# Altium schematic sheet DELA EPROMMER II.SchDoc
size 420 x 297 mm; ApprovedBy: .; CheckedBy: .; Author: DiWou; CompanyName: DL2DW; DrawnBy: DiWou; Engineer: .; Organization: DL2DW; DocumentNumber: 1; Revision: -; SheetNumber: 1; SheetTotal: 1; DrawnDate: 13.05.2018; EngrDate: .; ChkdDate: .; Title1: DELA EPROMMER II; Title2: .; Title3: .; Desc1: Version 1.0; Desc2: .; ApprDate: .
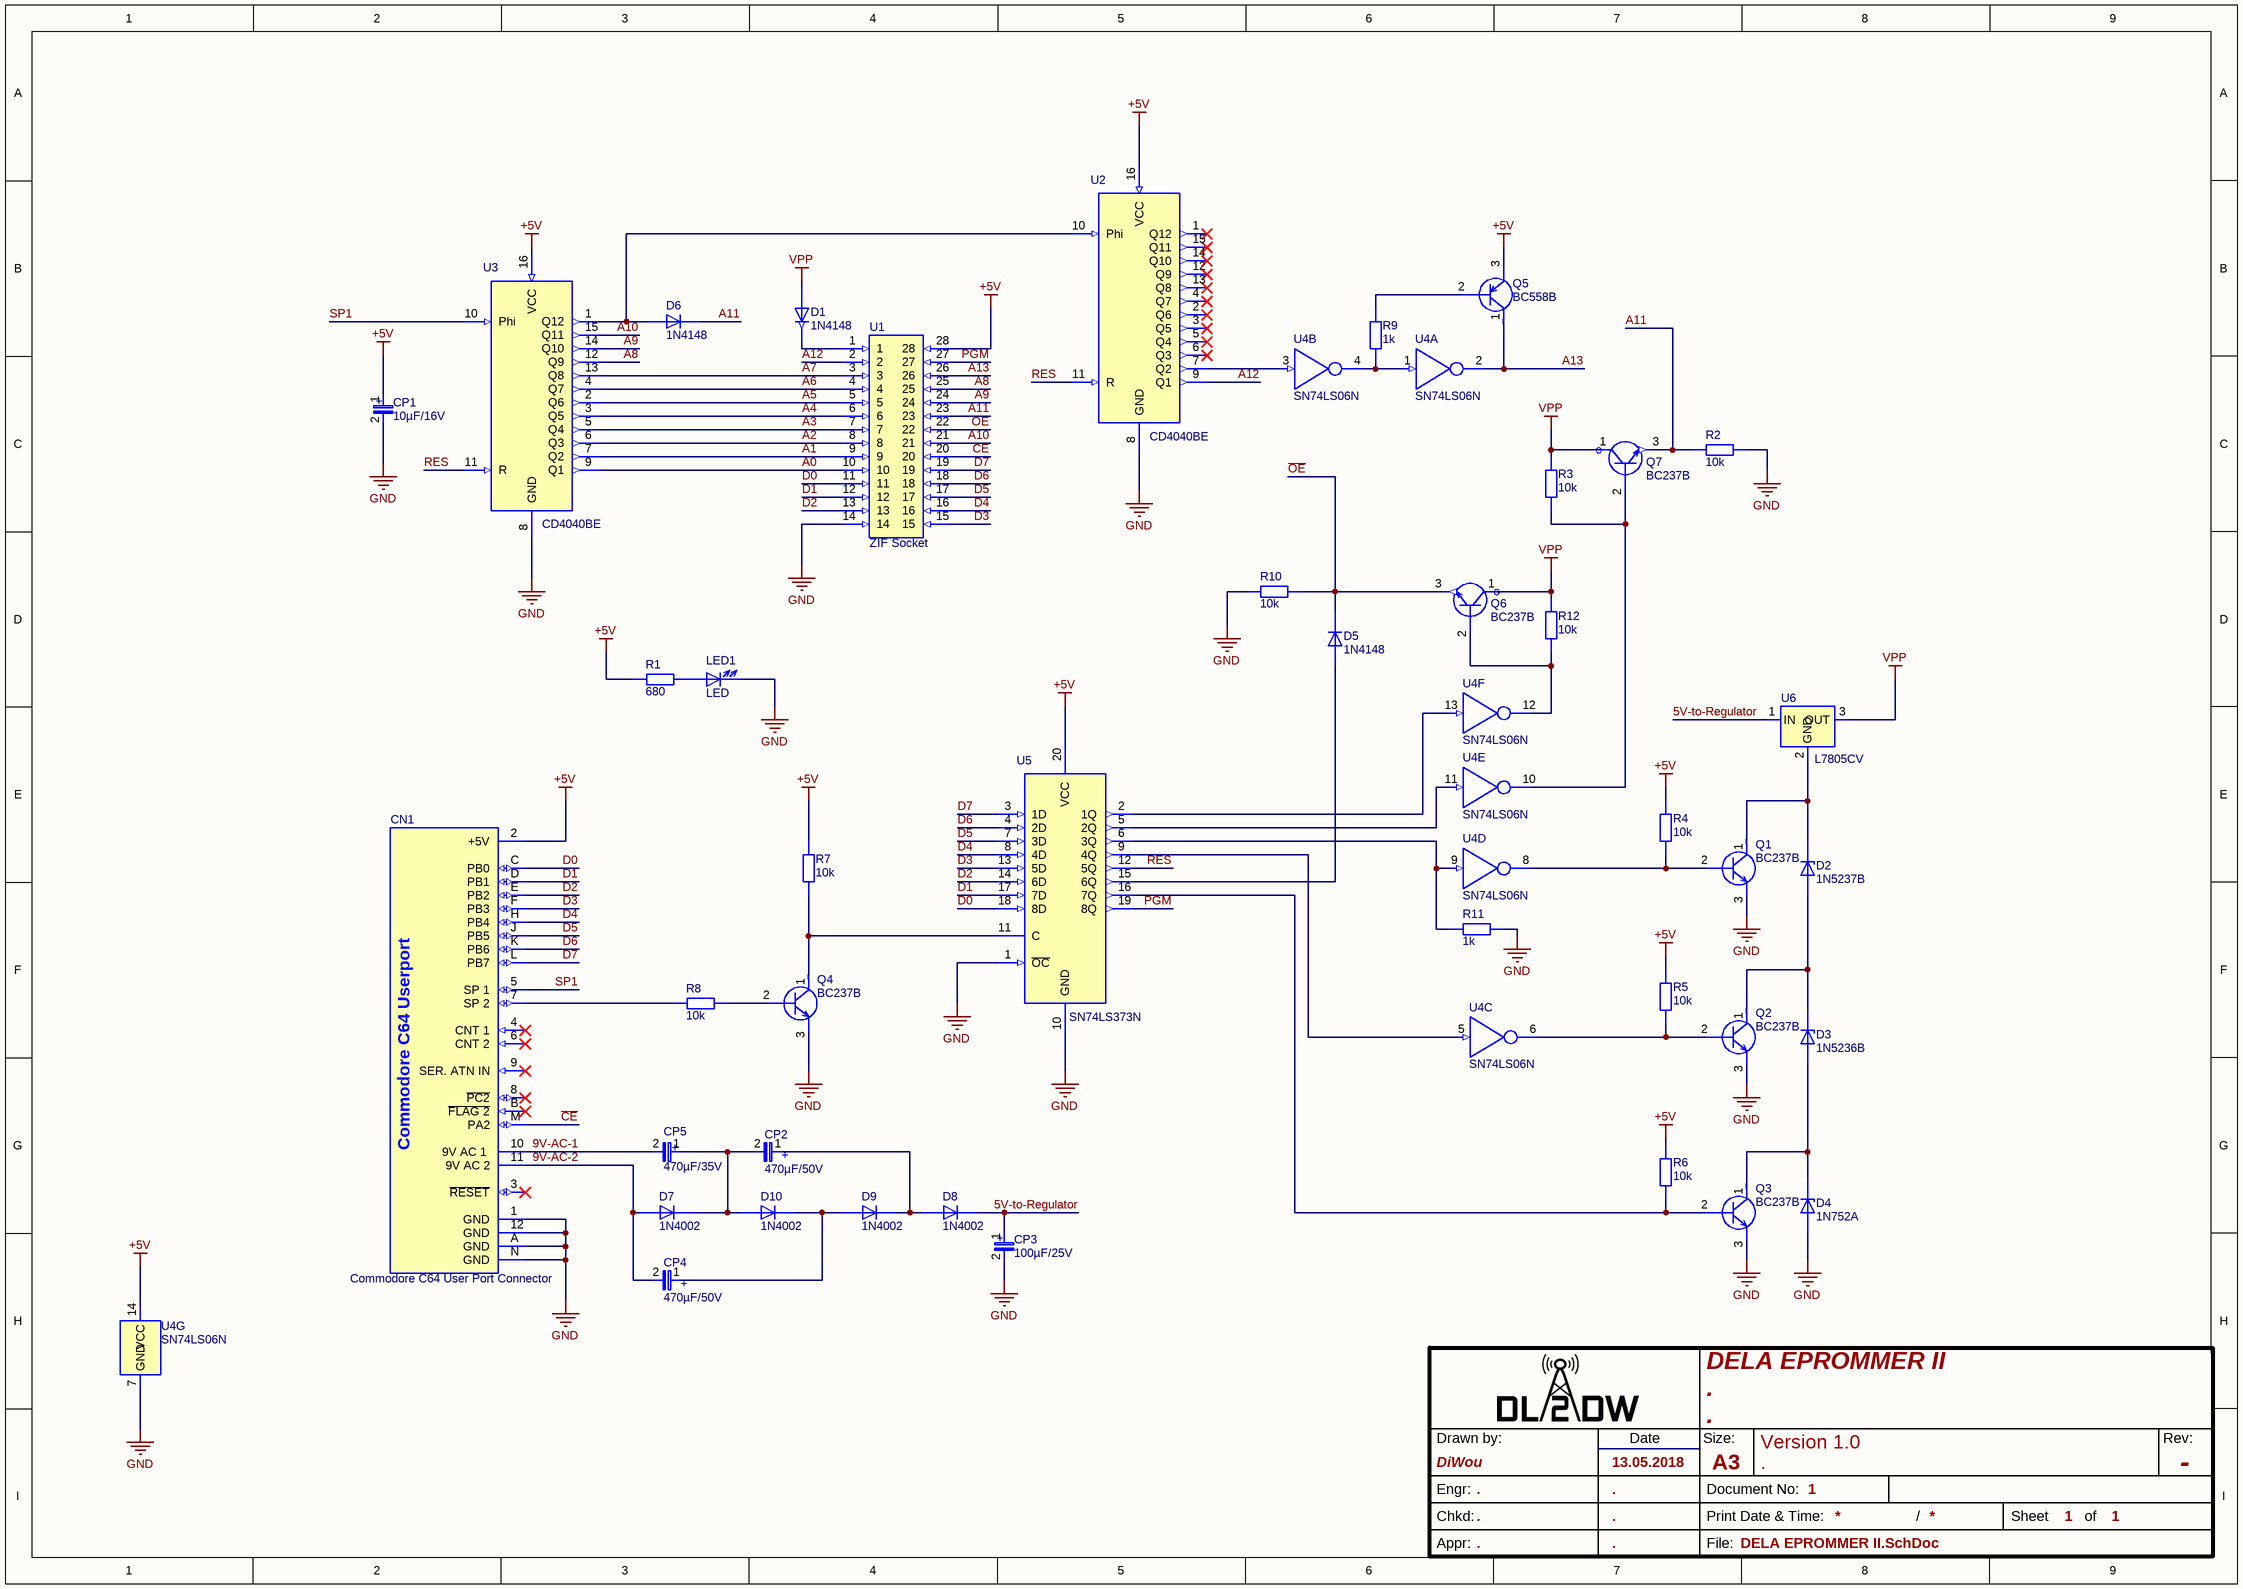
[diagram p0: DELA EPROMMER II.SchDoc]

## Parts
CN1  Commodore C64 User Port Connector  [C64 User Port Connector]
CP1  10µF/16V  [CAP Elec 10µF 16V RND 150EHR100M16B]
CP2  470µF/50V  [CAP Elec. 470µF 50V Panasonic ECA1HHG471]
CP3  100µF/25V  [CAP Elec 100µF 25V Panasonic ECA1EHG101]
CP4  470µF/50V  [CAP Elec. 470µF 50V Panasonic ECA1HHG471]
CP5  470µF/35V  [CAP Elec 470µF 35V Panasonic ECA1VHG471]
D1  1N4148  [1N4148 P=5.08mm]
D2  1N5237B  [1N5237B  P=5.08mm]
D3  1N5236B  [1N5236B  P=5.08mm]
D4  1N752A  [1N752A P=5.08mm]
D5  1N4148  [1N4148 P=5.08mm]
D6  1N4148  [1N4148 P=5.08mm]
D7  1N4002  [1N4002 P=7.62mm]
D8  1N4002  [1N4002 P=7.62mm]
D9  1N4002  [1N4002 P=7.62mm]
D10  1N4002  [1N4002 P=7.62mm]
LED1  LED  [LED 3mm Red Straight]
Q1  BC237B  [BC237]
Q2  BC237B  [BC237]
Q3  BC237B  [BC237]
Q4  BC237B  [BC237]
Q5  BC558B  [BC558B]
Q6  BC237B  [BC237]
Q7  BC237B  [BC237]
R1  680  [680 kOhm R Axial DIN0207 L6.3mm D2.5mm P7.62mm Horizontal]
R2  10k  [10 kOhm R Axial DIN0207 L6.3mm D2.5mm P7.62mm Horizontal]
R3  10k  [10 kOhm R Axial DIN0207 L6.3mm D2.5mm P7.62mm Horizontal]
R4  10k  [10 kOhm R Axial DIN0207 L6.3mm D2.5mm P7.62mm Horizontal]
R5  10k  [10 kOhm R Axial DIN0207 L6.3mm D2.5mm P7.62mm Horizontal]
R6  10k  [10 kOhm R Axial DIN0207 L6.3mm D2.5mm P7.62mm Horizontal]
R7  10k  [10 kOhm R Axial DIN0207 L6.3mm D2.5mm P7.62mm Horizontal]
R8  10k  [10 kOhm R Axial DIN0207 L6.3mm D2.5mm P7.62mm Horizontal]
R9  1k  [1,0 kOhm R Axial DIN0207 L6.3mm D2.5mm P7.62mm Horizontal]
R10  10k  [10 kOhm R Axial DIN0207 L6.3mm D2.5mm P7.62mm Horizontal]
R11  1k  [1,0 kOhm R Axial DIN0207 L6.3mm D2.5mm P7.62mm Horizontal]
R12  10k  [10 kOhm R Axial DIN0207 L6.3mm D2.5mm P7.62mm Horizontal]
U1  ZIF Socket  [ZIF Socket Textool 28pos P=15.24mm]
U2  CD4040BE  [CD4040BE with Socket]
U3  CD4040BE  [CD4040BE with Socket]
U4  SN74LS06N  [SN74LS06N with Socket]  (parts A,B,C,D,E,F,G of 7)
U5  SN74LS373N  [SN74LS373N with Socket]
U6  L7805CV  [L 7805 CV]

## Nets
+5V: CN1.2(+5V) CP1.1 Q5.3 R1.2 R4.1 R5.1 R6.1 R7.1 U1.28 U2.16(VCC) U3.16(VCC) U4.14(VCC) U5.20(VCC)
GND: CN1.1(GND) CN1.12(GND) CN1.A(GND) CN1.N(GND) CP1.2 CP3.2 D4.2 LED1.1 Q1.3 Q2.3 Q3.3 Q4.3 R2.1 R10.2 R11.2 U1.14 U2.8(GND) U3.8(GND) U4.7(GND) U5.1(~{OC}) U5.10(GND)
VPP: D1.2 Q6.1 Q7.1 R3.1 R12.1 U6.3(OUT)
5V-to-Regulator: CP3.1 D8.1 U6.1(IN)
9V-AC-1: CN1.10(9V_AC_1) CP5.2
9V-AC-2: CN1.11(9V_AC_2) CP4.2 D7.2
A0: U1.10 U3.9(Q1)
A1: U1.9 U3.7(Q2)
A2: U1.8 U3.6(Q3)
A3: U1.7 U3.5(Q4)
A4: U1.6 U3.3(Q5)
A5: U1.5 U3.2(Q6)
A6: U1.4 U3.4(Q7)
A7: U1.3 U3.13(Q8)
A8: U1.25 U3.12(Q9)
A9: U1.24 U3.14(Q10)
A10: U1.21 U3.15(Q11)
A11: D6.1 Q7.3 R2.2 U1.23
A12: U1.2 U2.9(Q1)
A13: Q5.1 U1.26 U4.2(1Y)
~{CE}: CN1.M(PA2) U1.20
D0: CN1.C(PB0) U1.11 U5.18(8D)
D1: CN1.D(PB1) U1.12 U5.17(7D)
D2: CN1.E(PB2) U1.13 U5.14(6D)
D3: CN1.F(PB3) U1.15 U5.13(5D)
D4: CN1.H(PB4) U1.16 U5.8(4D)
D5: CN1.J(PB5) U1.17 U5.7(3D)
D6: CN1.K(PB6) U1.18 U5.4(2D)
D7: CN1.L(PB7) U1.19 U5.3(1D)
~{OE}: D5.1 Q6.3 R10.1 U1.22
~{PGM}: U1.27 U5.19(8Q)
RES: U2.11(R) U3.11(R) U5.12(5Q)
SP1: CN1.5(SP_1) U3.10(Phi)
NetCN1_7: CN1.7(SP_2) R8.1
NetCP2_1: CP2.1 D8.2 D9.1
NetCP2_2: CP2.2 CP5.1 D7.1 D10.2
NetCP4_1: CP4.1 D9.2 D10.1
NetD1_1: D1.1 U1.1
NetD2_1: D2.1 Q1.1 U6.2(GND)
NetD2_2: D2.2 D3.1 Q2.1
NetD3_2: D3.2 D4.1 Q3.1
NetD5_2: D5.2 U5.15(6Q)
NetD6_2: D6.2 U2.10(Phi) U3.1(Q12)
NetLED1_2: LED1.2 R1.1
NetQ1_2: Q1.2 R4.2 U4.8(4Y)
NetQ2_2: Q2.2 R5.2 U4.6(3Y)
NetQ3_2: Q3.2 R6.2 U5.16(7Q)
NetQ4_1: Q4.1 R7.2 U5.11(C)
NetQ4_2: Q4.2 R8.2
NetQ5_2: Q5.2 R9.1
NetQ6_2: Q6.2 R12.2 U4.12(6Y)
NetQ7_2: Q7.2 R3.2 U4.10(5Y)
NetR9_2: R9.2 U4.1(1A) U4.4(2Y)
NetR11_1: R11.1 U4.9(4A) U5.6(3Q)
NetU2_7: U2.7(Q2) U4.3(2A)
NetU4_5: U4.5(3A) U5.9(4Q)
NetU4_11: U4.11(5A) U5.5(2Q)
NetU4_13: U4.13(6A) U5.2(1Q)

Not connected (* = marked no-connect by the designer): CN1 3(~{RESET})* 4(CNT_1)* 6(CNT_2)* 8(~{PC2})* 9(SER._ATN_IN)* B(~{FLAG_2})*; U2 1(Q12)* 2(Q6)* 3(Q5)* 4(Q7)* 5(Q4)* 6(Q3)* 12(Q9)* 13(Q8)* 14(Q10)* 15(Q11)*; U6 4(N/C)

## Notes on the sheet
- Drawn by:
- Date
- Size:
- A3
- Rev:
- Engr:
- Chkd:
- Appr:
- File:
- Document No:
- Print Date & Time:
- /
- Sheet
- of
- (in symbol CMP-Capacitors-Electrolyt_Capacitors00019-2) +
- (in symbol CMP-Capacitors-Electrolyt_Capacitors00020-1) +
- (in symbol CMP-Capacitors-Electrolyt_Capacitors00021-1) +
- (in symbol CMP-Capacitors-Electrolyt_Capacitors00022-1) +
- (in symbol CMP-Commodore-00001-1) Commodore C64 Userport

## Library data of the parts
CN1 = CMP-Commodore-00001-1: Connector for soldering on the board, for connection to the user port of the C64.
CP1 = CMP-Capacitors-Electrolyt_Capacitors00020-1: RND 150EHR100M16B - Kondensator, 10µF, 16V, 20%, RND Components
CP2 CP4 = CMP-Capacitors-Electrolyt_Capacitors00019-2: Capacitor 470 uF 50 VDC, ECA1HHG471, Panasonic Automotive & Industrial Systems; Lead/Base Style: Straight; Voltage: 50V; Dissipation Factor: 0.12%; Capacitance: 470uF; Ripple Current: 530mA; Lead Diameter: 0.6mm; Tolerance: 20%; Life (Hours): 2000Hour; Leakage Current: 3uA; Height - Seated (Max): 0.866inch; Number of Pins: 2; Package Quantity: 200; Voltage Rating (DC): 50V; Radiation Hardening: No; Max Operating Temperature: 105°C; Ripple Current (AC): 530mA; Lead Pitch: 5mm; Diameter: 10mm; REACH SVHC: No SVHC; Termination: Radial; Mount: Through Hole,PCB; Case/Package: Radial; Contact Plating: Tin; Length: 20mm; Min Operating Temperature: -55°C; Height: 20mm; Packaging: Bulk; Voltage Rating: 50V
CP3 = CMP-Capacitors-Electrolyt_Capacitors00022-1: Capacitor 100 uF 25 VDC, ECA1EHG101, Panasonic Automotive & Industrial Systems; Polarity: Polar; Voltage Rating (DC): 25V; Lead Diameter: 0.5mm; Dissipation Factor: 0.16%; Capacitance: 100uF; Ripple Current (AC): 130mA; Tolerance: 20%; Lead/Base Style: Straight; Life (Hours): 1000Hour; Leakage Current: 3uA; Height - Seated (Max): 0.48inch; Packaging: Bulk; Termination: Radial; Voltage Rating: 25V; Number of Pins: 2; Length: 11.2mm; Height: 11.2mm; Min Operating Temperature: -55°C; Diameter: 6.3mm; Lead Pitch: 2.5mm; Width: 0inch; Max Operating Temperature: 105°C; Case/Package: Radial; Mount: Through Hole,PCB; REACH SVHC: No SVHC; Package Quantity: 200; Voltage: 25V; Radiation Hardening: No; Ripple Current: 130mA
CP5 = CMP-Capacitors-Electrolyt_Capacitors00021-1: ALUMINUM ELECTROLYTIC CAPACITOR, 470UF, 35V, 20%, RADIAL; Product Range:NHG Series; Capacitance:470 F; Capacitance Tolerance: 20%; Voltage Rating:35V; Diameter:10mm; Capacitor Terminals:Radial Leaded; Packaging:Each; ESR:- ;RoHS Compliant: Yes; Polarity: Polar; Leakage Current: 3uA; Ripple Current: 460mA; Dielectric Material: Aluminium; Life (Hours): 2000Hour; Lead/Base Style: Straight; Dissipation Factor: 0.14%; Lead Diameter: 0.6mm; Height: 16mm; Lead Free: Lead Free; Max Operating Temperature: 105°C; Voltage Rating (DC): 35V; Termination: Radial; Tolerance: 20%; Voltage: 35V; Voltage Rating: 35V; Case/Package: Radial; Length: 16mm; Contact Plating: Tin; Capacitance: 470uF; Min Operating Temperature: -55°C; REACH SVHC: No SVHC; Package Quantity: 200; Height - Seated (Max): 0.669inch; Number of Pins: 2; Diameter: 10mm; Lead Pitch: 5mm; Mount: Through Hole,PCB; Packaging: Bulk; Radiation Hardening: No
D1 D5 D6 = CMP-Diodes-00002-4: NEXPERIA - 1N4148 - DIODE, 1N4148 AMMO-BOX 10K; Reverse Recovery Time: 4ns; Capacitance: 4pF; Element Configuration: Single; Current: 4A; Output Current: 200mA; Voltage Rating (DC): 100V; Max Power Dissipation: 500mW; Polarity: Standard; Forward Voltage: 1V; Weight: 0.01lb; Lead Free: Lead Free; Length: 2.5inch; Termination: Axial; Voltage: 100V; Forward Current: 200mA; Width: 0.25inch; Packaging: Ammo Pack; Max Repetitive Reverse Voltage (Vrrm): 100V; Max Operating Temperature: 200°C; Number of Pins: 2; Case/Package: SOD; Max Forward Surge Current (Ifsm): 4A; Height: 0.25inch; Peak Non-Repetitive Surge Current: 4A; Radiation Hardening: No; REACH SVHC: No SVHC; Current Rating: 200mA; Min Operating Temperature: -65°C
D2 = CMP-Diodes-00017-1: ZENER DIODE, 500mW, 8.2V, DO-35; Zener Voltage Vz Typ:8.2V; Power Dissipation Pd:500mW; Diode Case Style:DO-35; Zener Tolerance :5%; No. of Pins:2Pins; Operating Temperature Max:200 C; Packaging:Each; Breakdown Voltage:8.2V ;RoHS Compliant: Yes; Zener Current: 20mA; Voltage Tolerance: 5%; Peak Reverse Current: 3uA; Element Configuration: Single; Impedance: 8R; Forward Voltage: 1.2V; Height: 0.5inch; Lead Free: Lead Free; Max Operating Temperature: 200°C; Weight: 80g; Width: 0.5inch; Max Power Dissipation: 500mW; Packaging: Bulk; Tolerance: 5%; Package Quantity: 1000; Power Rating: 500mW; REACH SVHC: No SVHC; Working Voltage: 8.2V; Power Dissipation: 500mW; Min Operating Temperature: -65°C; Mount: Through Hole; Test Current: 20mA; Radiation Hardening: No; Max Reverse Leakage Current: 3uA; Voltage Rating (DC): 8.2V; Number of Pins: 2; Breakdown Voltage: 8.2V; Length: 0.5inch; Zener Voltage: 8.2V
D3 = CMP-Diodes-00016-1: FAIRCHILD SEMICONDUCTOR         1N5236B             Zener Single Diode, 7.5 V, 500 mW, DO-35, 5 %, 2 Pins, 200 C; Max Power Dissipation: 500mW; Peak Reverse Current: 3uA; Zener Voltage: 7.5V; Impedance: 6R; Test Current: 20mA; Voltage Tolerance: 5%; Forward Voltage: 1.2V; Mount: Through Hole; Voltage Rating (DC): 7.5V; Min Operating Temperature: -65°C; Weight: 0.01lb; Power Dissipation: 500mW; Width: 1.91mm; Element Configuration: Single; Lead Free: Lead Free; Zener Current: 20mA; Packaging: Bulk; Max Reverse Leakage Current: 3uA; Working Voltage: 7.5V; REACH SVHC: No SVHC; Power Rating: 500mW; Package Quantity: 1000; Tolerance: 5%; Number of Pins: 2; Height: 1.91mm; Radiation Hardening: No; Max Operating Temperature: 200°C; Length: 4.56mm
D4 = CMP-Diodes-00015-1: Zener Diode 5.6V 1/2 Watt 5% Do-35 Case; Max Power Dissipation: 500mW; REACH SVHC: Unknown; Zener Voltage: 5.6V; Max Operating Temperature: 200°C; Number of Pins: 2
D7-D10 = CMP-Diodes-00001-2: DIODE GEN PURP 100V 1A DO41; Capacitance: 15pF; Forward Voltage: 1.1V; Polarity: Standard; Peak Reverse Current: 5uA; Max Forward Surge Current (Ifsm): 30A; Element Configuration: Single; Power Dissipation: 3W; Forward Current: 1A; Reverse Voltage: 100V; Mount: Through Hole; Diameter: 2.72mm; Height: 2.72mm; Max Operating Temperature: 175°C; Number of Pins: 2; Voltage Rating (DC): 100V; Contact Plating: Tin,Matte; Peak Non-Repetitive Surge Current: 30A; Width: 2.72mm; Package Quantity: 1000; Average Rectified Current: 1A; Max Repetitive Reverse Voltage (Vrrm): 100V; Max Surge Current: 30A; Weight: 0.245g; Min Operating Temperature: -55°C; Packaging: Tape and Reel; REACH SVHC: No SVHC; Termination: Axial; Radiation Hardening: No; Output Current: 1A; Current Rating: 1A; Length: 5.2mm; Lead Free: Lead Free; Max Reverse Voltage (DC): 100V
LED1 = CMP-LEDs-00000-1: WURTH ELEKTRONIK   151033RS03000   LED, 3MM,  RED, 2600MCD, 621NM; Viewing Angle: 30°; Test Current: 20mA; Forward Current: 30mA; Lens Style: Clear,Circular,Round; Forward Voltage: 2V; Packaging: Bulk; Height: 5.55mm; Color: Red; Wavelength: 621nm; Max Operating Temperature: 85°C; Luminous Intensity: 2600mcd; Dominant Wavelength: 621nm; REACH SVHC: Unknown; Mount: Through Hole; Lens Size: 3mm; Package Quantity: 1; Case/Package: Radial; Min Operating Temperature: -40°C
Q1-Q4 Q6 Q7 = CMP-Transistors-00008-1: MULTICOMP         BC237B            Bipolar (BJT) Single Transistor, NPN, 45 V, 200 MHz, 350 mW, 100 mA, 290; Collector Emitter Voltage (VCEO): 45V; Transition Frequency: 200MHz; Max Power Dissipation: 350mW; Polarity: NPN; Number of Pins: 3; Case/Package: TO-92; Max Operating Temperature: 150°C; Collector Emitter Breakdown Voltage: 45V; Power Dissipation: 350mW; REACH SVHC: No SVHC
Q5 = CMP-Transistors-00007-1: FAIRCHILD SEMICONDUCTOR         BC558BTA             Bipolar (BJT) Single Transistor, PNP, -30 V, 150 MHz, 500 mW, -100 mA, 200 hFE; Max Collector Current: 100mA; Collector Emitter Saturation Voltage: -250mV; Power Dissipation: 500mW; Transition Frequency: 150MHz; Collector Emitter Breakdown Voltage: 30V; Max Frequency: 10MHz; Emitter Base Voltage (VEBO): -5V; Collector Base Voltage (VCBO): -30V; Number of Elements: 1; Current Rating: -100mA; hFE Min: 110; Contact Plating: Tin,Matte; Weight: 0.24g; Case/Package: TO-92; Lead Free: Lead Free; Max Operating Temperature: 150°C; Collector Emitter Voltage (VCEO): 30V; Gain Bandwidth Product: 150MHz; Packaging: Ammo Pack; Height: 5.33mm; REACH SVHC: No SVHC; Voltage Rating (DC): -30V; Length: 5.2mm; Frequency: 150MHz; Mount: Through Hole; Package Quantity: 2000; Element Configuration: Single; Max Breakdown Voltage: 30V; Number of Pins: 3; Min Operating Temperature: -65°C; Polarity: PNP; Width: 4.19mm; Max Power Dissipation: 500mW
R1 = CMP-Resistors-Yageo_THT_DIN_0207-00140-1: Res 680K Ohm 1/4W 5% Axial; Resistance: 680kR; Max Power Dissipation: 250mW; Temperature Coefficient: -700ppm/°C; Package Quantity: 200; Composition: Carbon Film; Max Operating Temperature: 155°C; Packaging: Bulk; Number of Terminations: 2; Min Operating Temperature: -55°C; Length: 0.248inch; Case/Package: Axial; Tolerance: 5%
R2-R8 R10 R12 = CMP-Resistors-Yageo_THT_DIN_0207-00096-1: RES 10K OHM 1/4W 5% AXIAL; Resistance: 10kR; Temperature Coefficient: 500ppm/°C; Max Power Dissipation: 250mW; Case/Package: Axial; Number of Terminations: 2; Composition: Carbon Film; Packaging: Bulk; Min Operating Temperature: -55°C; Lead Free: Lead Free; Package Quantity: 200; Max Operating Temperature: 155°C; Length: 0.248inch; Tolerance: 5%
R9 R11 = CMP-Resistors-Yageo_THT_DIN_0207-00072-1: RES 1K OHM 1/4W 5% AXIAL; Max Power Dissipation: 250mW; Resistance: 1kR; Temperature Coefficient: 500ppm/°C; Composition: Carbon Film; Lead Free: Lead Free; Case/Package: Axial; Packaging: Bulk; Length: 0.248inch; Min Operating Temperature: -55°C; Tolerance: 5%; Number of Terminations: 2; Package Quantity: 200; Max Operating Temperature: 155°C; Power Rating: 250mW
U1 = CMP-Mechanicals-00022-1: CONN IC DIP SOCKET ZIF 28POS GLD; Row Spacing: 0.4inch; Number of Positions: 28; Gender: Female; Pitch: 2.54mm; Voltage Rating: 1kV; Current Rating: 1A; Body Material: Glass,Polysulfone; Termination: Through Hole; Depth: 11.9mm; Contact Material: Copper; Package Quantity: 10; Mount: Through Hole; Flammability Rating: UL94 V-0; Number of Contacts: 28; Housing Material: Polysulfone; Max Operating Temperature: 150°C; Packaging: Rail/Tube; Min Operating Temperature: -55°C; Lead Free: Lead Free; Width: 17.8mm; Length: 50.5mm; Contact Plating: Gold; Orientation: Straight
U2 U3 = CMP-ICs-40xx-series-0003-1: Counter/Divider Single 12-Bit Binary UP 16-Pin PDIP Tube; Propagation Delay: 360ns; Input Capacitance: 5pF; Max Supply Voltage: 18V; Power Dissipation: 500mW; Number of Bits per Element: 12; Frequency: 24MHz; Min Supply Voltage: 3V; Clock Edge Trigger Type: Negative Edge; Number of Elements: 1; Quiescent Current: 100uA; Direction: Unidirectional; Reset: Asynchronous; Width: 6.35mm; Turn-On Delay Time: 360ns; Max Operating Temperature: 125°C; Weight: 0.03357oz; Packaging: Rail/Tube; REACH SVHC: No SVHC; Contact Plating: Gold; Mount: Through Hole; Radiation Hardening: No; Logic Function: Counter; Lead Free: Lead Free; Package Quantity: 25; Number of Pins: 16; Length: 19.3mm; Min Operating Temperature: -55°C; Height: 4.57mm; Case/Package: PDIP; Number of Bits: 12
U4 = CMP-ICs-74xx-series-00008-2: IC INVERTER OPEN COL 6CH 14DIP; Turn-On Delay Time: 20ns; Operating Supply Voltage: 5V; Schmitt Trigger Input: No; Number of Circuits: 6; Number of Inputs: 1; Low Level Output Current: 40mA; Polarity: Inverting; High Level Output Current: -250uA; Max Supply Voltage: 5.25V; Logic Function: Buffer,Inverter,Inverting; Min Supply Voltage: 4.75V; Nominal Supply Current: 100uA; Max Operating Temperature: 70°C; Height: 4.57mm; Radiation Hardening: No; Mount: Through Hole; Number of Pins: 14; Min Operating Temperature: 0°C; Termination: Through Hole; Case/Package: PDIP; Number of Outputs: 6; Lead Free: Lead Free; Number of Elements: 6; Packaging: Rail/Tube; Number of Output Lines: 6; REACH SVHC: No SVHC; Length: 19.3mm; Number of Channels: 6; Propagation Delay: 20ns; Number of Gates: 6; Number of Bits: 6; Number of Input Lines: 6; Width: 6.35mm; Package Quantity: 25
U5 = CMP-ICs-74xx-series-00062-1: Latch Transparent 3-ST 8-CH D-Type 20-Pin PDIP Tube; Max Supply Voltage: 5.25V; Number of Circuits: 8; Logic Function: D-Type,Latch,Flip-Flop; Low Level Output Current: 24mA; Number of Output Lines: 1; Propagation Delay: 18ns; Number of Input Lines: 3; Operating Supply Current: 40mA; Min Supply Voltage: 4.75V; Polarity: Non-Inverting; Operating Supply Voltage: 5V; Turn-On Delay Time: 12ns; High Level Output Current: -2.6mA; Weight: 0.042297oz; Number of Bits: 8; Max Operating Temperature: 70°C; Package Quantity: 20; Number of Outputs: 8; Case/Package: PDIP; Quiescent Current: 24mA; Min Operating Temperature: 0°C; Width: 6.35mm; Contact Plating: Gold; Lead Free: Lead Free; Number of Elements: 1; Mount: Through Hole; Number of Channels: 8; Height: 4.57mm; REACH SVHC: No SVHC; Number of Pins: 20; Packaging: Rail/Tube; Output Current: 24mA; Radiation Hardening: No; Independent Circuits: 1; Length: 24.33mm
U6 = CMP-ICs-Power_Supply-00004-8: STMICROELECTRONICS - L7806CV - LINEAR VOLTAGE REGULATOR 6V TO-220-3; Dropout Voltage: 2V; Quiescent Current: 8mA; Max Input Voltage: 35V; Power Supply Rejection Ratio (PSRR): 59dB; Number of Outputs: 1; Min Input Voltage: 8V; Tolerance: 5%; Output Current: 1.5A; Output Type: Fixed; Polarity: Positive; Lead Free: Lead Free; Min Operating Temperature: 0°C; Nominal Output Voltage: 6V; Min Output Voltage: 6V; Length: 10.4mm; Number of Pins: 3; Output Voltage: 6V; Mount: Through Hole; Height: 9.15mm; Width: 4.6mm; Package Quantity: 50; Contact Plating: Tin,Matte; Radiation Hardening: No; Case/Package: TO; Max Operating Temperature: 125°C; REACH SVHC: No SVHC; Max Output Current: 1.5A; Packaging: Rail/Tube; Number of Regulators: 1; Weight: 0.08113oz